# EasyEDA schematic AchszaehlerMesseinheitCH32V003F4P6-Minimum.json
TITLE: Sheet_1; REV: 1.0; Date: 2025-05-25; Sheet: 1/1; Drawn By: spamundwerbung3; Company: Your Company
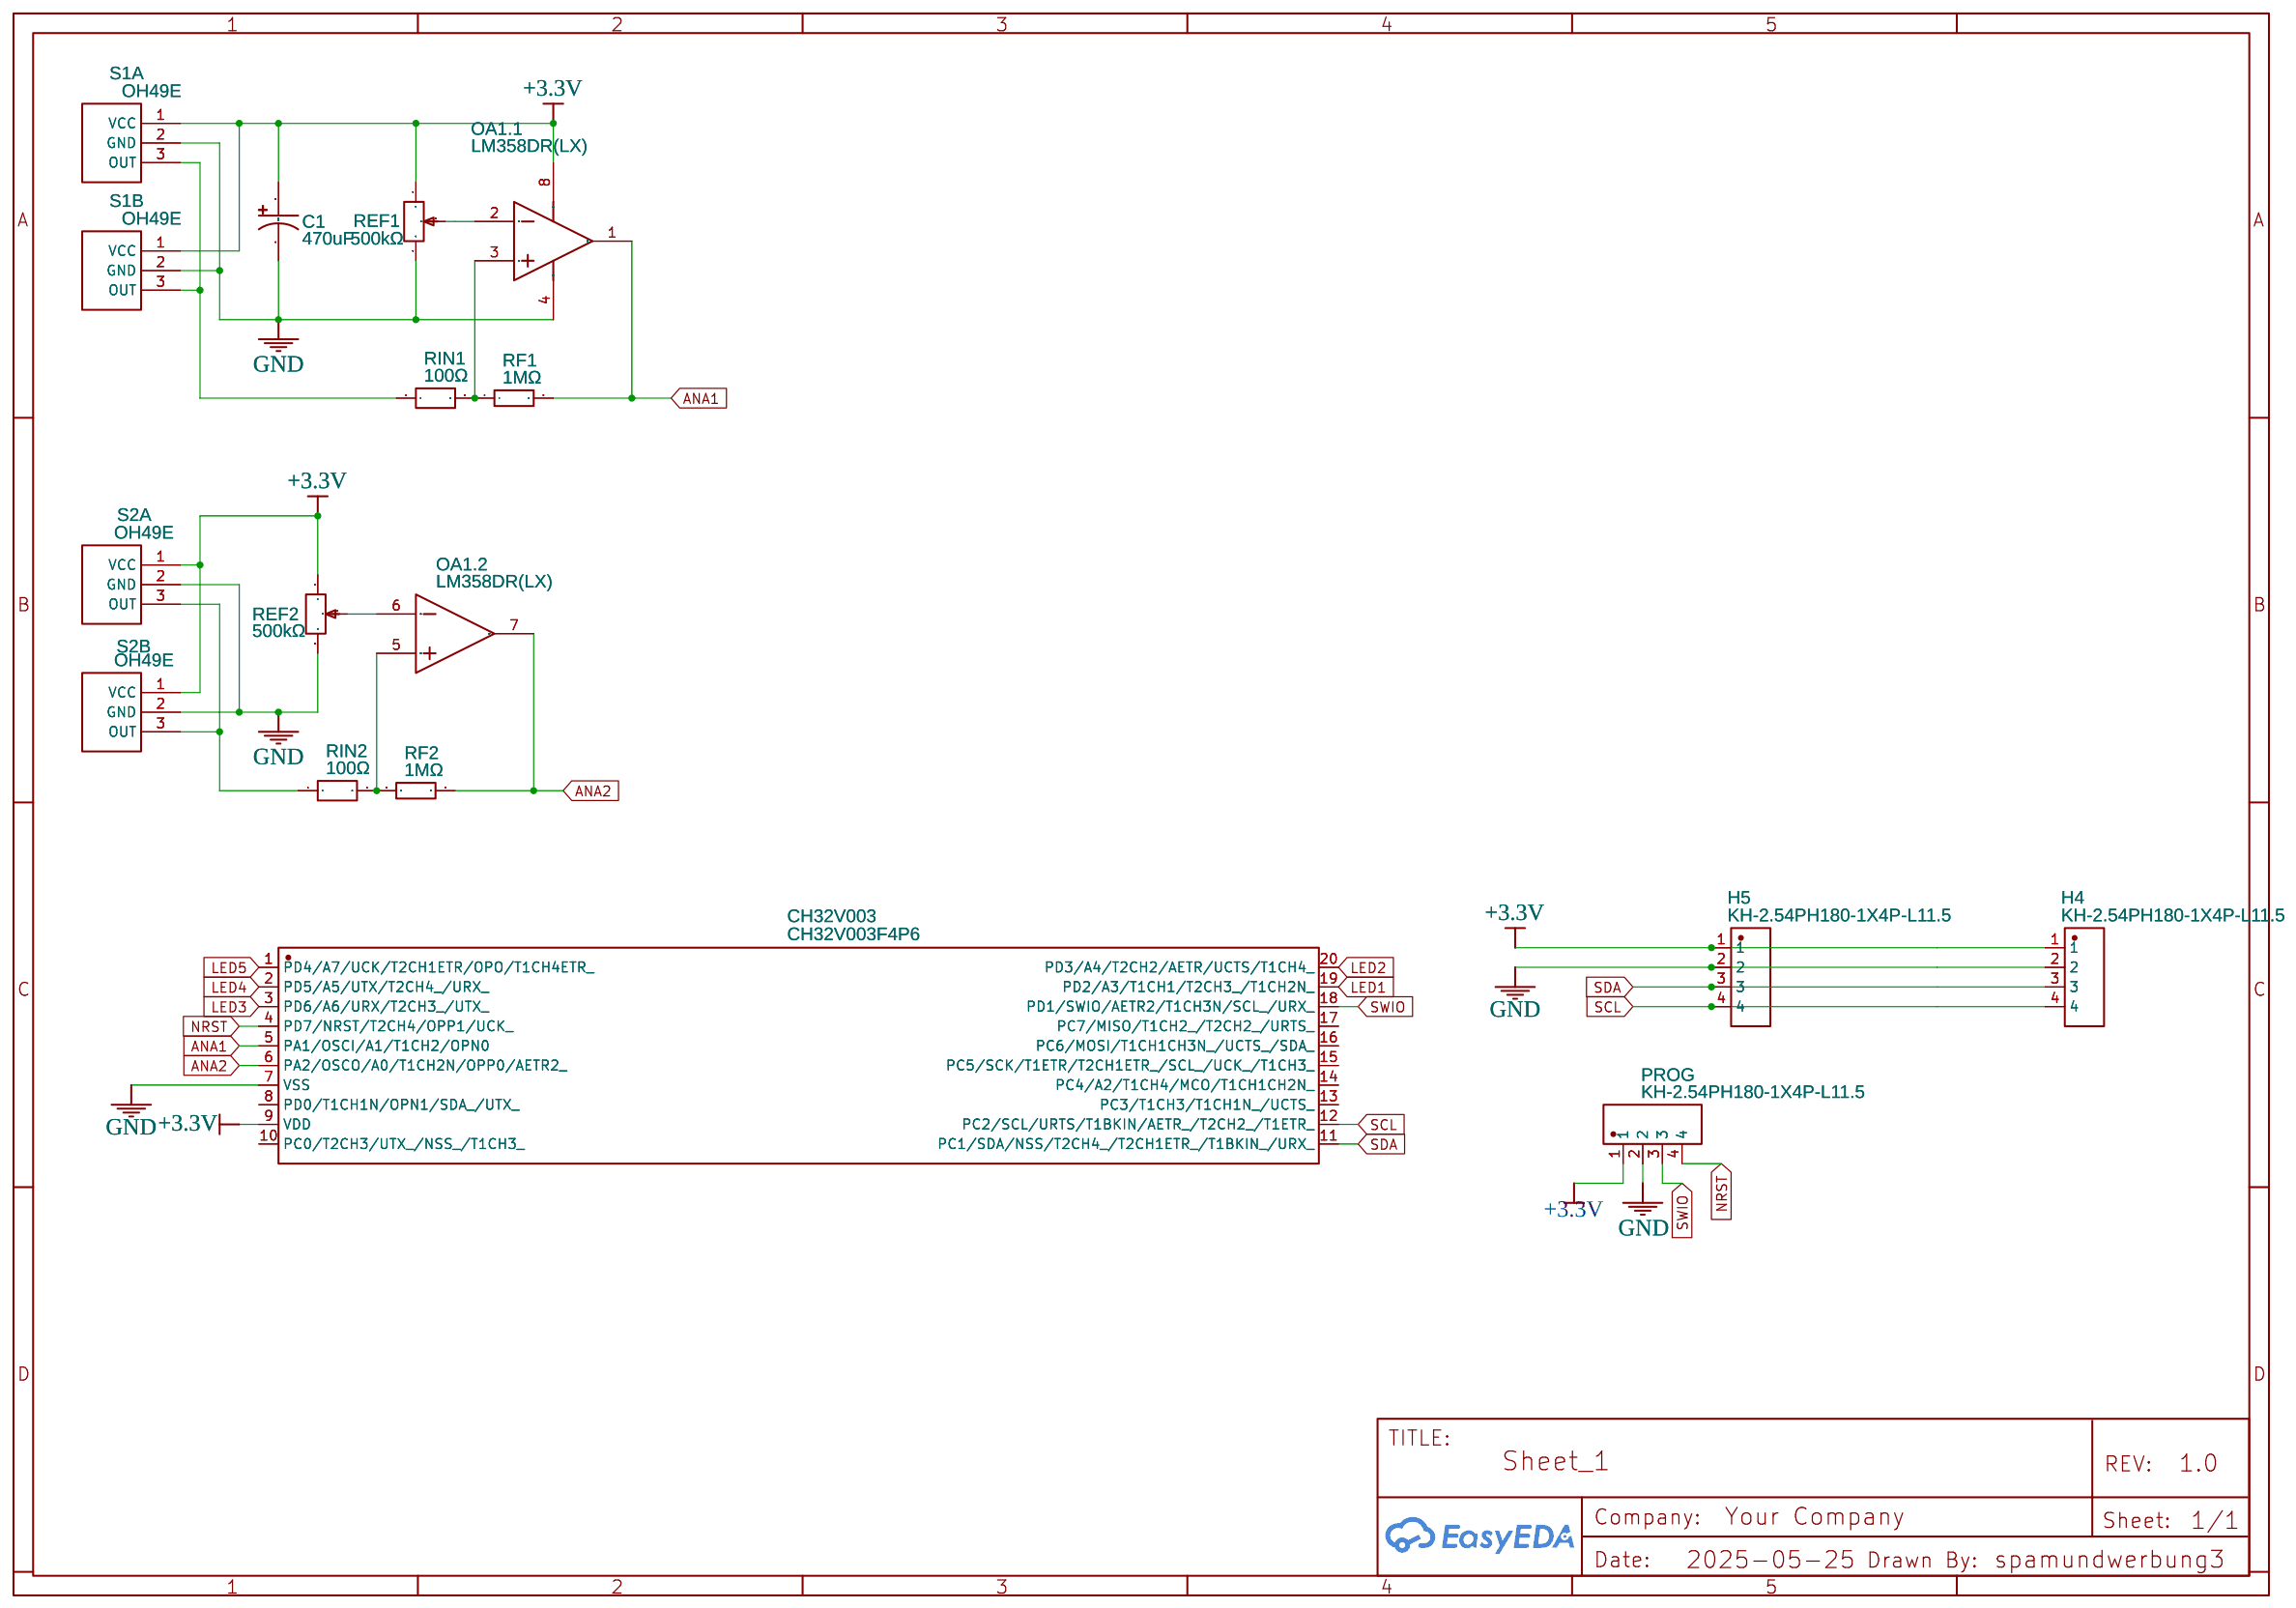
[diagram p0: schematic sheet]

## Parts
C1  470uF  [CAP-TH_BD6.3-P2.50-D1.0-FD]
CH32V003  CH32V003F4P6  [TSSOP-20_L6.5-W4.4-P0.65-LS6.4-BL]
H4  KH-2.54PH180-1X4P-L11.5  [HDR-TH_4P-P2.54-V-M]
H5  KH-2.54PH180-1X4P-L11.5  [HDR-TH_4P-P2.54-V-M]
OA1  LM358DR(LX)  [SOP-8_L4.9-W3.9-P1.27-LS6.0-BL]  (sections 1,2)
PROG  KH-2.54PH180-1X4P-L11.5  [HDR-TH_4P-P2.54-V-M]
REF1  500kΩ  [RES-ADJ-SMD_RM065-V1]
REF2  500kΩ  [RES-ADJ-SMD_RM065-V1]
RF1  1MΩ  [R0603]
RF2  1MΩ  [R0603]
RIN1  100Ω  [R0603]
RIN2  100Ω  [R0603]
S1A  OH49E  [OH49E]
S1B  OH49E  [OH49E]
S2A  OH49E  [OH49E]
S2B  OH49E  [OH49E]

## Library data of the parts
C1 = UKW1A471MED: Contributor: LCSC; Supplier: LCSC; Supplier Part: C250972; Manufacturer: Nichicon(尼吉康); JLCPCB Part Class: Extended Part
CH32V003 = CH32V003F4P6: Contributor: lcsc; Supplier: LCSC; Supplier Part: C5187096; Manufacturer: WCH(南京沁恒); JLCPCB Part Class: Extended Part
H4 H5 PROG = KH-2.54PH180-1X4P-L11.5: Contributor: LCSC; Supplier: LCSC; Supplier Part: C2905435; Manufacturer: kinghelm(金航标); JLCPCB Part Class: Extended Part
OA1 = LM358DR(LX): Supplier: LCSC; Supplier Part: C24833647; Manufacturer: LX(灵星芯微); JLCPCB Part Class: Extended Part; subpart_no: 1
REF1 REF2 = RM065-504(500K) VARIABLE TRIANGULAR: Contributor: lcsc; Supplier: LCSC; Supplier Part: C5205026; Manufacturer: BOCHEN(博晨); Manufacturer Part: RM065-504(500K)
RF1 RF2 = ETCR0603F1M00K9: Contributor: LCSC; Supplier: LCSC; Supplier Part: C365401; Manufacturer: RESI(开步睿思); JLCPCB Part Class: Extended Part
RIN1 RIN2 = CR0603-10W-1000FT: Supplier: LCSC; Supplier Part: C4041881; Manufacturer: Venkel; JLCPCB Part Class: Extended Part; Contributor: lcsc
S1A S1B S2A S2B = OH49E: Supplier: LCSC; Manufacturer: OUZHUO; image: //image.lceda.cn/szlcsc/C81386.jpg; Supplier Part: C81386

## Nets
+3.3V: C1.1 CH32V003.9(VDD) H4.1 H5.1 OA1.8(VCC+) PROG.1 REF1.1 REF2.1 S1A.1(VCC) S1B.1(VCC) S2A.1(VCC) S2B.1(VCC)
GND: C1.2 CH32V003.7(VSS) H4.2 H5.2 OA1.4(VCC-) PROG.2 REF1.3 REF2.3 S1A.2(GND) S1B.2(GND) S2A.2(GND) S2B.2(GND)
ANA1: CH32V003.5(PA1/OSCI/A1/T1CH2/OPN0) OA1.1(1OUT) RF1.2
ANA2: CH32V003.6(PA2/OSCO/A0/T1CH2N/OPP0/AETR2_) OA1.7(2OUT) RF2.2
LED1: CH32V003.19(PD2/A3/T1CH1/T2CH3_/T1CH2N_)
LED2: CH32V003.20(PD3/A4/T2CH2/AETR/UCTS/T1CH4_)
LED3: CH32V003.3(PD6/A6/URX/T2CH3_/UTX_)
LED4: CH32V003.2(PD5/A5/UTX/T2CH4_/URX_)
LED5: CH32V003.1(PD4/A7/UCK/T2CH1ETR/OPO/T1CH4ETR_)
NRST: CH32V003.4(PD7/NRST/T2CH4/OPP1/UCK_) PROG.4
SCL: CH32V003.12(PC2/SCL/URTS/T1BKIN/AETR_/T2CH2_/T1ETR_) H4.4 H5.4
SDA: CH32V003.11(PC1/SDA/NSS/T2CH4_/T2CH1ETR_/T1BKIN_/URX_) H4.3 H5.3
SWIO: CH32V003.18(PD1/SWIO/AETR2/T1CH3N/SCL_/URX_) PROG.3
Net-(OA1.1-2): OA1.2(1IN-) REF1.2
Net-(OA1.1-3): OA1.3(1IN+) RF1.1 RIN1.2
Net-(OA1.2-5): OA1.5(2IN+) RF2.1 RIN2.2
Net-(OA1.2-6): OA1.6(2IN-) REF2.2
Net-(RIN1-1): RIN1.1 S1A.3(OUT) S1B.3(OUT)
Net-(RIN2-1): RIN2.1 S2A.3(OUT) S2B.3(OUT)

Not connected (* = marked no-connect by the designer): CH32V003 8(PD0/T1CH1N/OPN1/SDA_/UTX_) 10(PC0/T2CH3/UTX_/NSS_/T1CH3_) 13(PC3/T1CH3/T1CH1N_/UCTS_) 14(PC4/A2/T1CH4/MCO/T1CH1CH2N_) 15(PC5/SCK/T1ETR/T2CH1ETR_/SCL_/UCK_/T1CH3_) 16(PC6/MOSI/T1CH1CH3N_/UCTS_/SDA_) 17(PC7/MISO/T1CH2_/T2CH2_/URTS_)
